# EAGLE schematic DasAltimeter v1.1 (EAGLE 8.4.0)
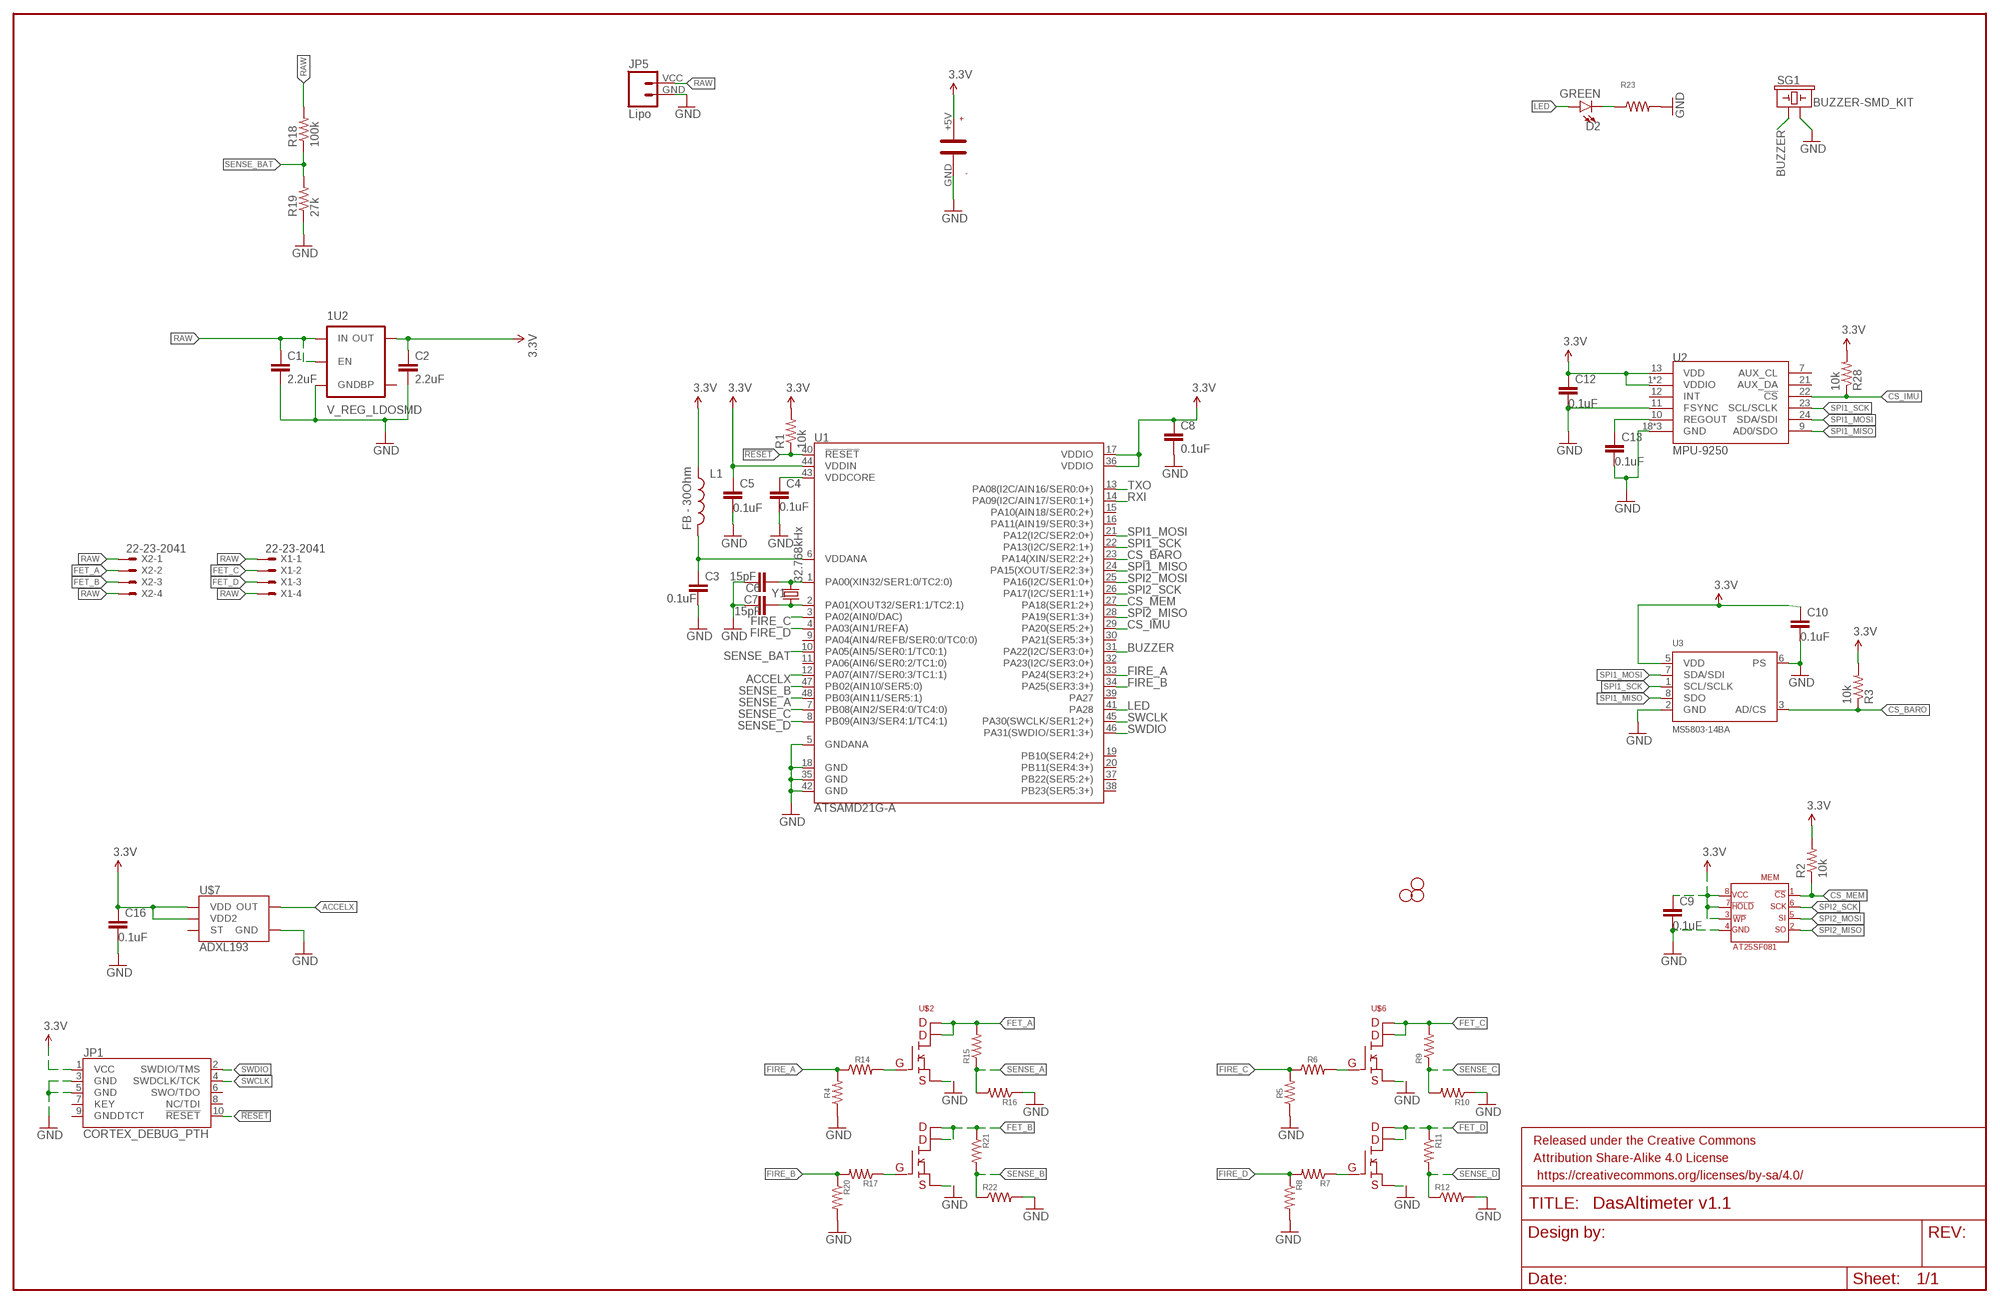
[diagram p0: schematic, sheet 1]

## Parts
1U2  V_REG_LDOSMD  [SOT23-5]
C1  2.2uF  CAP0603-CAP  [0603-CAP]
C2  2.2uF  CAP0603-CAP  [0603-CAP]
C3  0.1uF  CAP0402-CAP  [0402-CAP]
C4  0.1uF  CAP0402-CAP  [0402-CAP]
C5  0.1uF  CAP0402-CAP  [0402-CAP]
C6  15pF  CAP0402-CAP  [0402-CAP]
C7  15pF  CAP0402-CAP  [0402-CAP]
C8  0.1uF  CAP0402-CAP  [0402-CAP]
C9  0.1uF  CAP0402-CAP  [0402-CAP]
C10  0.1uF  CAP0402-CAP  [0402-CAP]
C12  0.1uF  CAP0402-CAP  [0402-CAP]
C13  0.1uF  CAP0402-CAP  [0402-CAP]
C16  0.1uF  CAP0402-CAP  [0402-CAP]
D2  GREEN  LED-GREEN1206  [LED-1206]
FRAME1  FRAME-LEDGER  [CREATIVE_COMMONS]
JP1  CORTEX_DEBUG_PTH  [2X5-PTH-1.27MM]
JP5  Lipo  M024UCON-15767  [JST-2-SMD-VERT]
L1  FB - 30Ohm  INDUCTOR0603  [0603]
MEM  AT25SF081  [AT25SF081]
R1  10k  RESISTOR0402-RES  [0402-RES]
R2  10k  RESISTOR0402-RES  [0402-RES]
R3  10k  RESISTOR0402-RES  [0402-RES]
R4  RESISTOR0402  [0402]
R5  RESISTOR0402  [0402]
R6  RESISTOR0402  [0402]
R7  RESISTOR0402  [0402]
R8  RESISTOR0402  [0402]
R9  RESISTOR0402  [0402]
R10  RESISTOR0402  [0402]
R11  RESISTOR0402  [0402]
R12  RESISTOR0402  [0402]
R14  RESISTOR0402  [0402]
R15  RESISTOR0402  [0402]
R16  RESISTOR0402  [0402]
R17  RESISTOR0402  [0402]
R18  100k  RESISTOR0402-RES  [0402-RES]
R19  27k  RESISTOR0402-RES  [0402-RES]
R20  RESISTOR0402  [0402]
R21  RESISTOR0402  [0402]
R22  RESISTOR0402  [0402]
R23  RESISTOR0402  [0402]
R28  10k  RESISTOR0402-RES  [0402-RES]
SG1  BUZZER-SMD_KIT  [BUZZER-CCV-KIT]
STANDOFF2  STAND-OFF  [STAND-OFF]
STANDOFF3  STAND-OFF  [STAND-OFF]
STANDOFF4  STAND-OFF  [STAND-OFF]
U1  ATSAMD21G-A  [TQFP-48]
U2  MPU-9250  [QFN24_PAD]
U3  MS5803-14BA  [MS5803]
U$1  PB-5R0H104-R  [PB-5R0H104-R]
U$2  SI7232DN  [SI7232DN]
U$6  SI7232DN  [SI7232DN]
U$7  ADXL193  [LCC-8]
X1  22-23-2041  [22-23-2041]
X2  22-23-2041  [22-23-2041]
Y1  32.768kHx  CRYSTAL3.2X1.5MM  [CRYSTAL-SMD-3.2X1.5MM]

## Nets
3.3V: 1U2.5(OUT) C2.1 C5.1 C8.1 C9.1 C10.1 C12.1 C16.1 JP1.1(VCC) L1.1 MEM.!HOLD MEM.!WP MEM.VCC R1.2 R2.2 R3.2 R28.2 U1.17(VDDIO) U1.36(VDDIO) U1.44(VDDIN) U2.1(VDDIO) U2.8(VDDIO) U2.13(VDD) U3.5(VDD) U$1.+5V U$7.P$7(VDD) U$7.P$8(VDD2)
!RESET: JP1.10(!RESET) R1.1 U1.40(!RESET!)
ACCELX: U1.12(PA07(AIN7/SER0:3/TC1:1)) U$7.P$6(OUT)
BUZZER: SG1.+ U1.31(PA22(I2C/SER3:0+))
CS_BARO: R3.1 U1.23(PA14(XIN/SER2:2+)) U3.3(AD/CS)
CS_IMU: R28.1 U1.29(PA20(SER5:2+)) U2.22(!CS)
CS_MEM: MEM.!CS R2.1 U1.27(PA18(SER1:2+))
FET_A: R15.2 U$2.7(PIN7) U$2.8(PIN8) X2.2
FET_B: R21.1 U$2.5(PIN5) U$2.6(PIN6) X2.3
FET_C: R9.2 U$6.7(PIN7) U$6.8(PIN8) X1.2
FET_D: R11.1 U$6.5(PIN5) U$6.6(PIN6) X1.3
FIRE_A: R4.2 R14.1 U1.33(PA24(SER3:2+))
FIRE_B: R17.2 R20.1 U1.34(PA25(SER3:3+))
FIRE_C: R5.2 R6.1 U1.3(PA02(AIN0/DAC))
FIRE_D: R7.2 R8.1 U1.4(PA03(AIN1/REFA))
GND: 1U2.2(GND) C1.2 C2.2 C3.2 C4.2 C5.2 C6.2 C7.2 C8.2 C9.2 C10.2 C12.2 C13.2 C16.2 JP1.3(GND) JP1.5(GND) JP5.GND MEM.GND R4.1 R5.1 R8.2 R10.1 R12.2 R16.1 R19.1 R20.2 R22.2 R23.2 SG1.- U1.5(GNDANA) U1.18(GND) U1.35(GND) U1.42(GND) U2.11(FSYNC) U2.18(GND) U2.20(GND) U2.CENTER(GND) U3.2(GND) U3.6(PS) U$1.GND U$2.1(PIN1) U$2.3(PIN3) U$6.1(PIN1) U$6.3(PIN3) U$7.P$3(GND)
LED: D2.A U1.41(PA28)
N$1: R6.2 U$6.2(PIN2)
N$3: C6.1 U1.1(PA00(XIN32/SER1:0/TC2:0)) Y1.P$2
N$4: C7.1 U1.2(PA01(XOUT32/SER1:1/TC2:1)) Y1.P$1
N$5: C3.1 L1.2 U1.6(VDDANA)
N$6: C4.1 U1.43(VDDCORE)
N$8: R7.1 U$6.4(PIN4)
N$12: R14.2 U$2.2(PIN2)
N$13: R17.1 U$2.4(PIN4)
N$29: D2.C R23.1
RAW: 1U2.1(IN) 1U2.3(EN) C1.1 JP5.VCC R18.2 X1.1 X1.4 X2.1 X2.4
REGOUT: C13.1 U2.10(REGOUT)
RXI: U1.14(PA09(I2C/AIN17/SER0:1+))
SENSE_A: R15.1 R16.2 U1.48(PB03(AIN11/SER5:1))
SENSE_B: R21.2 R22.1 U1.47(PB02(AIN10/SER5:0))
SENSE_BAT: R18.1 R19.2 U1.10(PA05(AIN5/SER0:1/TC0:1))
SENSE_C: R9.1 R10.2 U1.7(PB08(AIN2/SER4:0/TC4:0))
SENSE_D: R11.2 R12.1 U1.8(PB09(AIN3/SER4:1/TC4:1))
SPI1_MISO: U1.24(PA15(XOUT/SER2:3+)) U2.9(AD0/SDO) U3.8(SDO)
SPI1_MOSI: U1.21(PA12(I2C/SER2:0+)) U2.24(SDA/SDI) U3.7(SDA/SDI)
SPI1_SCK: U1.22(PA13(I2C/SER2:1+)) U2.23(SCL/SCLK) U3.1(SCL/SCLK)
SPI2_MISO: MEM.SO U1.28(PA19(SER1:3+))
SPI2_MOSI: MEM.SI U1.25(PA16(I2C/SER1:0+))
SPI2_SCK: MEM.SCK U1.26(PA17(I2C/SER1:1+))
SWCLK: JP1.4(SWDCLK/TCK) U1.45(PA30(SWCLK/SER1:2+))
SWDIO: JP1.2(SWDIO/TMS) U1.46(PA31(SWDIO/SER1:3+))
TXO: U1.13(PA08(I2C/AIN16/SER0:0+))
Unconnected: 1U2.4(BP) JP1.6(SWO/TDO) JP1.7(KEY) JP1.8(NC/TDI) JP1.9(GNDDTCT) U1.9(PA04(AIN4/REFB/SER0:0/TC0:0)) U1.11(PA06(AIN6/SER0:2/TC1:0)) U1.15(PA10(AIN18/SER0:2+)) U1.16(PA11(AIN19/SER0:3+)) U1.19(PB10(SER4:2+)) U1.20(PB11(SER4:3+)) U1.30(PA21(SER5:3+)) U1.32(PA23(I2C/SER3:0+)) U1.37(PB22(SER5:2+)) U1.38(PB23(SER5:3+)) U1.39(PA27) U2.7(AUX_CL) U2.12(INT) U2.21(AUX_DA) U$7.P$4(ST)

## Library data of the parts
1U2 = SparkFun-PowerIC:V_REG_LDO: Voltage Regulator LDO Standard 150mA LDO voltage regulator in SOT-23 layout. Micrel part MIC5205. BP (by-pass) pin is used to lower output noise with 470pF cap.
C1 C2 = SparkFun-Capacitors:CAP: Capacitor Standard 0603 ceramic capacitor, and 0.1" leaded capacitor.
C3-C10 C12 C13 C16 = SparkFun-Passives:CAP: Capacitor Standard 0603 ceramic capacitor, and 0.1" leaded capacitor.
D2 = SparkFun-LED:LED-GREEN: Green SMD LED Used in manufacturing of various products at SparkFun Packages: 0603 - SMD 0603 package [Product Link] <http://www.futureelectronics.com/en/technologies/semiconductors/optoelectronics/leds/Pages/9894312-LTST-C190GKT.aspx?CrossPart=HSMG-C190&IM=0> LilyPad 1206 - SMD1206 LilyPad package [Product Link] <http://www.futureelectronics.com/en/Technologies/Product.aspx?ProductID=IN150NGHARVATEKCORPORATION2049943&IM=0> 1206 - SMD1206 package [Product Link] <http://www.futureelectronics.com/en/technologies/semiconductors/optoelectronics/leds/Pages/8315665-LTST-C150KGKT.aspx?IM=0> 1206 Bottom Mount -SMD 1206 Bottom Mount [Product Link] <http://www.digikey.com/product-detail/en/lite-on-inc/LTST-C230KGKT/160-1456-1-ND/386854> SparkFun Products: Pro Mini 328 -5V <https://www.sparkfun.com/products/821> RedBoard <https://www.sparkfun.com/products/12757> MP3 Trigger <https://www.sparkfun.com/products/13720> Makey Makey <https://www.sparkfun.com/products/11076>; PROD_ID: DIO-00862
FRAME1 = SparkFun-Aesthetics:FRAME-LEDGER: Schematic Frame - Ledger Standard 11x14 US Ledger frame
JP1 = SparkFun-Connectors:CORTEX_DEBUG: Cortex Debug Connector - 10 pin Supports JTAG debug, Serial Wire debug, and Serial Wire Viewer. PTH and SMD connector options available. General Connector Information <http://infocenter.arm.com/help/topic/com.arm.doc.faqs/attached/13634/cortex_debug_connectors.pdf> Products: PTH Connector <http://www.digikey.com/product-detail/en/cnc-tech/3220-10-0100-00/1175-1627-ND/3883661> -via Digi-Key SparkFun PSoc <https://www.sparkfun.com/products/13229> SparkFun T <https://www.sparkfun.com/products/13810>
JP5 = SparkFun-Connectors:M02: Standard 2-pin 0.1" header. Use with - straight break away headers ( PRT-00116) - right angle break away headers (PRT-00553) - swiss pins (PRT-00743) - machine pins (PRT-00117) - female headers (PRT-00115) Molex polarized connector foot print use with: PRT-08233 with associated crimp pins and housings. 2.54_SCREWTERM for use with PRT-10571. 3.5mm Screw Terminal footprints for PRT-08084 5mm Screw Terminal footprints for use with PRT-08432
L1 = SparkFun-Passives:INDUCTOR: Inductors Basic Inductor/Choke - 0603 and 1206. Footprints are not proven and vary greatly between part numbers. INDUCTOR POWER 3.3UH 4.0A SMD 0.197" L x 0.197" W x 0.177" H (5.00mm x 5.00mm x 4.50mm)
MEM = SaL-lib:AT25SF081: AT25SF081 - 8M memory smd
R1-R3 R18 R19 R28 = SparkFun-Passives:RESISTOR: Resistor Basic schematic elements and footprints for 0603, 1206, and PTH resistors.
R4-R12 R14-R17 R20-R23 = SparkFun-Resistors:RESISTOR: Generic Resistor Package
SG1 = SparkFun-Electromechanical:BUZZER: Buzzer Small round buzzers that operate around the audible 2kHz range. You can use these as speakers to create simple music or user interfaces. Variant Overview: PTH - Mini Speaker - PC Mount 12mm 2.048kHz <https://www.sparkfun.com/products/7950> PTH_KIT - Mini Speaker - PC Mount 12mm 2.048kHz <https://www.sparkfun.com/products/7950> KIT simplifies soldering by adding stop mask to one side of the pads. PTH_NO_SILK - Mini Speaker - PC Mount 12mm 2.048kHz <https://www.sparkfun.com/products/7950> No silkscreen indicator of buzzer outline. PTH_KIT_NO_SILK - Mini Speaker - PC Mount 12mm 2.048kHz <https://www.sparkfun.com/products/7950> KIT package w/o silkscreen SMD - Buzzer Audio Magnetic (CCV-084B16) SMD buzzer used on, e.g. the LilyPad Buzzer <https://www.sparkfun.com/products/8463> and RFID USB Reader <https://www.sparkfun.com/products/9963>. SMD_KIT - Buzzer Audio Magnetic (CCV-084B16) SMD Buzzer with elongated pins to make soldering easier. Used on the SparkFun Simon Says - Surface Mount Soldering Kit <https://www.sparkfun.com/products/10935>.; PROD_ID: COMP-08568
STANDOFF2-STANDOFF4 = SparkFun-Electromechanical:STAND-OFF: #4 Stand Off This is the mechanical footprint for a #4 phillips button head screw. Use the keepout ring to avoid running the screw head into surrounding components. SKU : PRT-00447
U1 = SparkFun-DigitalIC:ATSAMD21G: Atmel SAMD21G SMART ARM-Based Microcontroller The Atmel ® | SMART ™ SAM D21 is a series of low-power microcontrollers using the 32-bit ARM ® Cortex ® -M0+ processor, and ranging from 32- to 64-pins with up to 256KB Flash and 32KB of SRAM. The SAM D21 devices operate at a maximum frequency of 48MHz and reach 2.46 CoreMark/MHz. They are designed for simple and intuitive migration with identical peripheral modules, hex compatible code, identical linear address map and pin compatible migration paths between all devices in the product series. All devices include intelligent and flexible peripherals, Atmel Event System for inter-peripheral signaling, and support for capacitive touch button, slider and wheel user interfaces.; PROD_ID: IC-13064
U2 = Testing:MPU-9250: NC pin 19. 2-6 & 14-17 not internally connected. May be used for PCB trace routing.; PROD_ID: IC-13192
U3 = MS5803:MS5803-14BA; PROD_ID: IC-12111
U$1 = SaL-lib1:PB-5R0H104-R
U$2 U$6 = SaL-lib:SI7232DN: SI7232DN dual
U$7 = SparkFun-Sensors:ADXL193: Analog Devices ADXL193 - 250g Accelerometer w/ Analog Output The ADXL193 is a small (5 mm x 5 mm x 2 mm ceramic LCC package), low power (1.5 mA current at 5V), single axis high-g iMEMS® accelerometer designed to sense shock and vibration at g-ranges of ±120g or ±250g. Three models are available and include AD22282-A-R2 (±120g) and AD22283-B-R2 (±250g). These products are used in a variety of crash/impact detection applications which include automotive airbag crash detection systems as well as medical, industrial, and sports equipment. Datasheet <https://www.sparkfun.com/datasheets/Sensors/Accelerometer/ADXL193.pdf> SparkFun Products SparkFun Single Axis Accelerometer Breakout - ADXL193 (+/-250g) <https://www.sparkfun.com/products/9332> (SEN-09332); PROD_ID: IC-09219
X1 X2 = con-molex:22-23-2041: .100" (2.54mm) Center Header - 4 Pin; MF: MOLEX; MPN: 22-23-2041; OC_FARNELL: 1462920; OC_NEWARK: 38C0355
Y1 = SparkFun-FreqCtrl:CRYSTAL: Various standard crystals. Proven footprints.

## Net classes
1 vcc: width 0.254 mm